# EAGLE design TBoard_2019 (EAGLE 9.1.0)
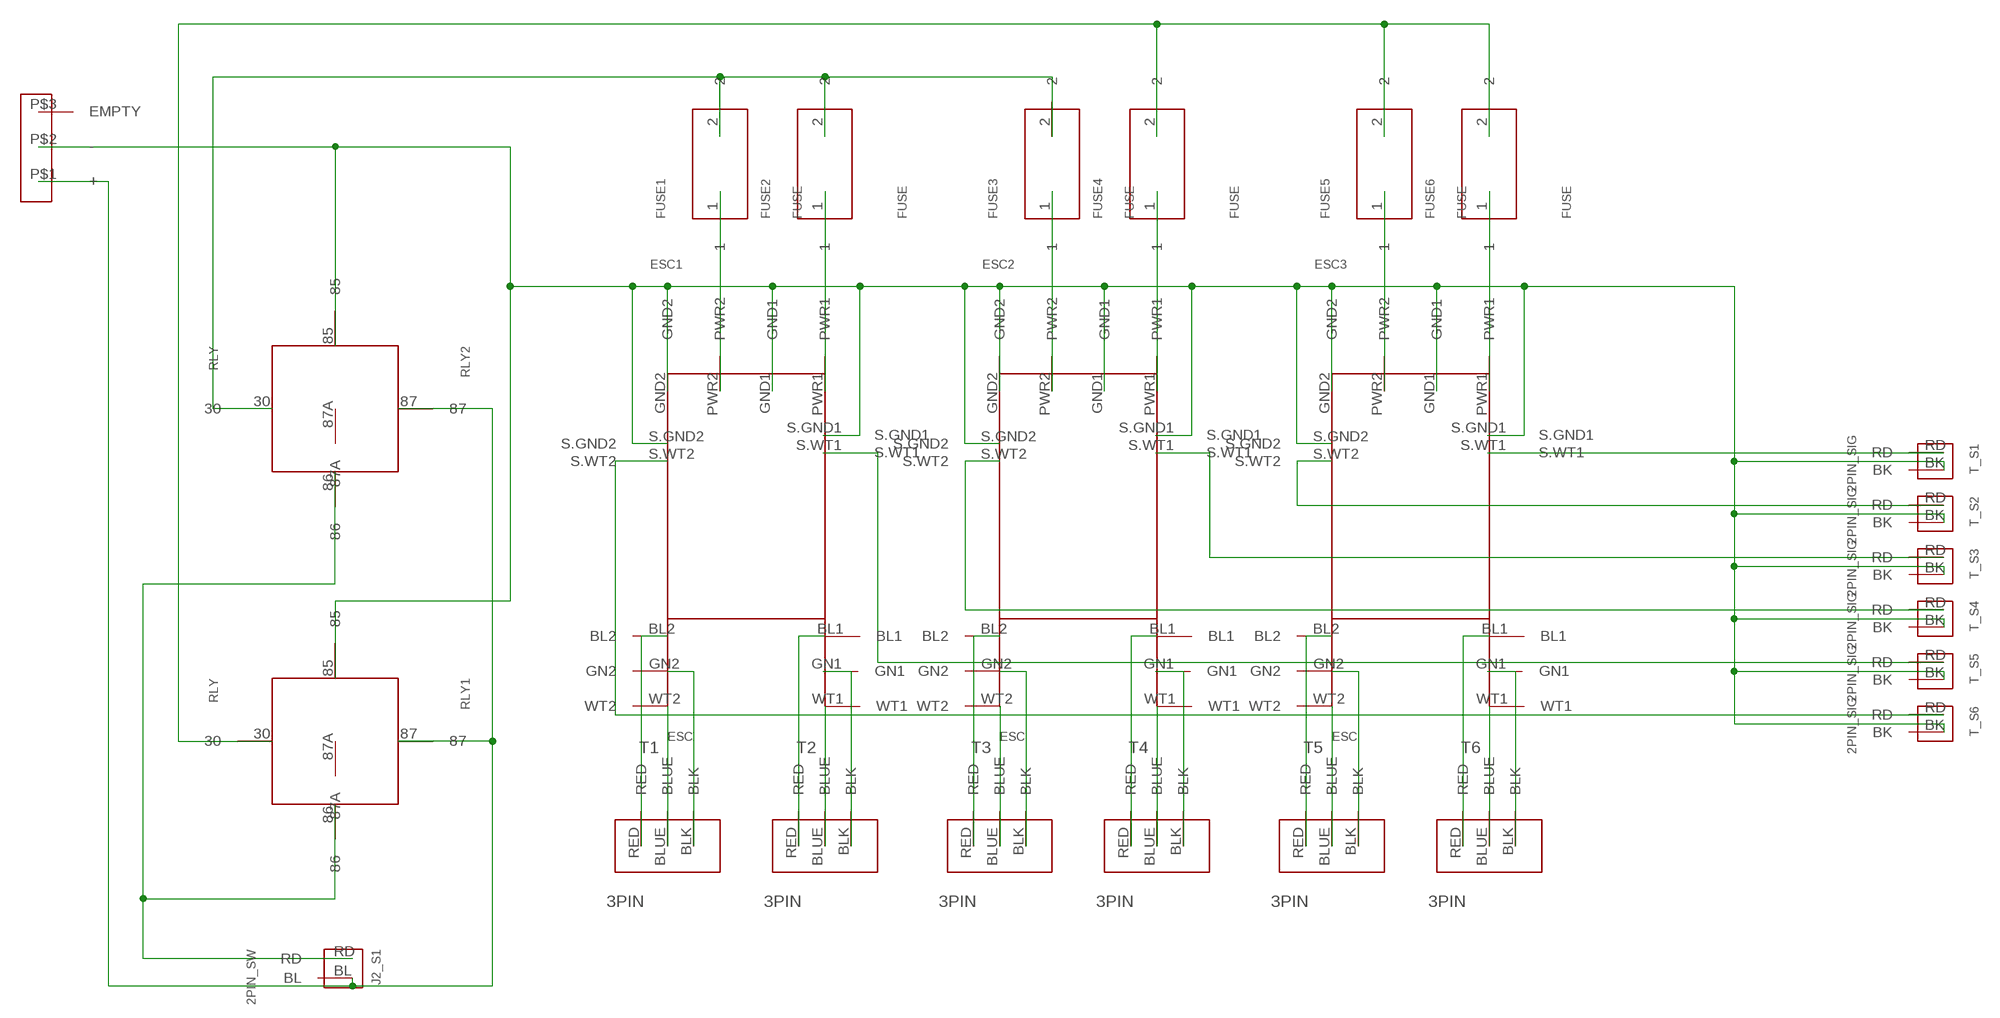
[diagram p0: schematic, sheet 1]

## Parts
ESC1  ESC  [ESC]
ESC2  ESC  [ESC]
ESC3  ESC  [ESC]
FUSE1  FUSE  [FUSE]
FUSE2  FUSE  [FUSE]
FUSE3  FUSE  [FUSE]
FUSE4  FUSE  [FUSE]
FUSE5  FUSE  [FUSE]
FUSE6  FUSE  [FUSE]
J2_S1  2PIN_SW  [2PIN_SW]
RLY1  RLY  [RLY]
RLY2  RLY  [RLY]
T1  3PIN  [3PIN]
T2  3PIN  [3PIN]
T3  3PIN  [3PIN]
T4  3PIN  [3PIN]
T5  3PIN  [3PIN]
T6  3PIN  [3PIN]
T_S1  2PIN_SIG  [2PIN_SIG]
T_S2  2PIN_SIG  [2PIN_SIG]
T_S3  2PIN_SIG  [2PIN_SIG]
T_S4  2PIN_SIG  [2PIN_SIG]
T_S5  2PIN_SIG  [2PIN_SIG]
T_S6  2PIN_SIG  [2PIN_SIG]
U$1  TERMINAL  [TERMINAL]

## Nets
N$1: ESC1.GND1 ESC1.GND2 ESC1.S.GND1 ESC1.S.GND2 ESC2.GND1 ESC2.GND2 ESC2.S.GND1 ESC2.S.GND2 ESC3.GND1 ESC3.GND2 ESC3.S.GND1 ESC3.S.GND2 RLY1.85 RLY2.85 T_S1.BK T_S2.BK T_S3.BK T_S4.BK T_S5.BK T_S6.BK U$1.P$2(-)
N$2: J2_S1.BL RLY1.87 RLY2.87 U$1.P$1(+)
N$3: J2_S1.RD RLY1.86 RLY2.86
N$4: ESC1.BL2 T1.RED
N$5: ESC1.GN2 T1.BLK
N$6: ESC1.WT2 T1.BLUE
N$7: ESC1.BL1 T2.RED
N$8: ESC1.GN1 T2.BLK
N$9: ESC1.WT1 T2.BLUE
N$10: ESC2.BL2 T3.RED
N$11: ESC2.GN2 T3.BLK
N$12: ESC2.WT2 T3.BLUE
N$13: ESC2.BL1 T4.RED
N$14: ESC2.GN1 T4.BLK
N$15: ESC2.WT1 T4.BLUE
N$16: ESC3.BL2 T5.RED
N$17: ESC3.GN2 T5.BLK
N$18: ESC3.WT2 T5.BLUE
N$19: ESC3.BL1 T6.RED
N$20: ESC3.GN1 T6.BLK
N$21: ESC3.WT1 T6.BLUE
N$22: FUSE4.2 FUSE5.2 FUSE6.2 RLY1.30
N$23: ESC1.PWR2 FUSE1.1
N$24: ESC1.PWR1 FUSE2.1
N$25: ESC2.PWR2 FUSE3.1
N$26: ESC2.PWR1 FUSE4.1
N$27: ESC3.PWR2 FUSE5.1
N$28: ESC3.PWR1 FUSE6.1
N$29: ESC3.S.WT1 T_S1.RD
N$30: ESC3.S.WT2 T_S2.RD
N$31: ESC2.S.WT1 T_S3.RD
N$32: ESC2.S.WT2 T_S4.RD
N$33: ESC1.S.WT1 T_S5.RD
N$34: ESC1.S.WT2 T_S6.RD
N$35: FUSE1.2 FUSE2.2 FUSE3.2 RLY2.30
Unconnected: RLY1.87A RLY2.87A U$1.P$3(EMPTY)

## Library data of the parts
ESC1-ESC3 = BLUE_ESC:ESC
FUSE1-FUSE6 = FUSE:FUSE
J2_S1 = 2PIN_BASE_SW:2PIN_SW
RLY1 RLY2 = 80A_RELAY:RLY
T1-T6 = 3PIN_BASE_CONNECTOR:3PIN
T_S1-T_S6 = 2PIN_BASE_SERVO:2PIN_SIG
U$1 = ThrusterBoardLibrary:TERMINAL

## Board
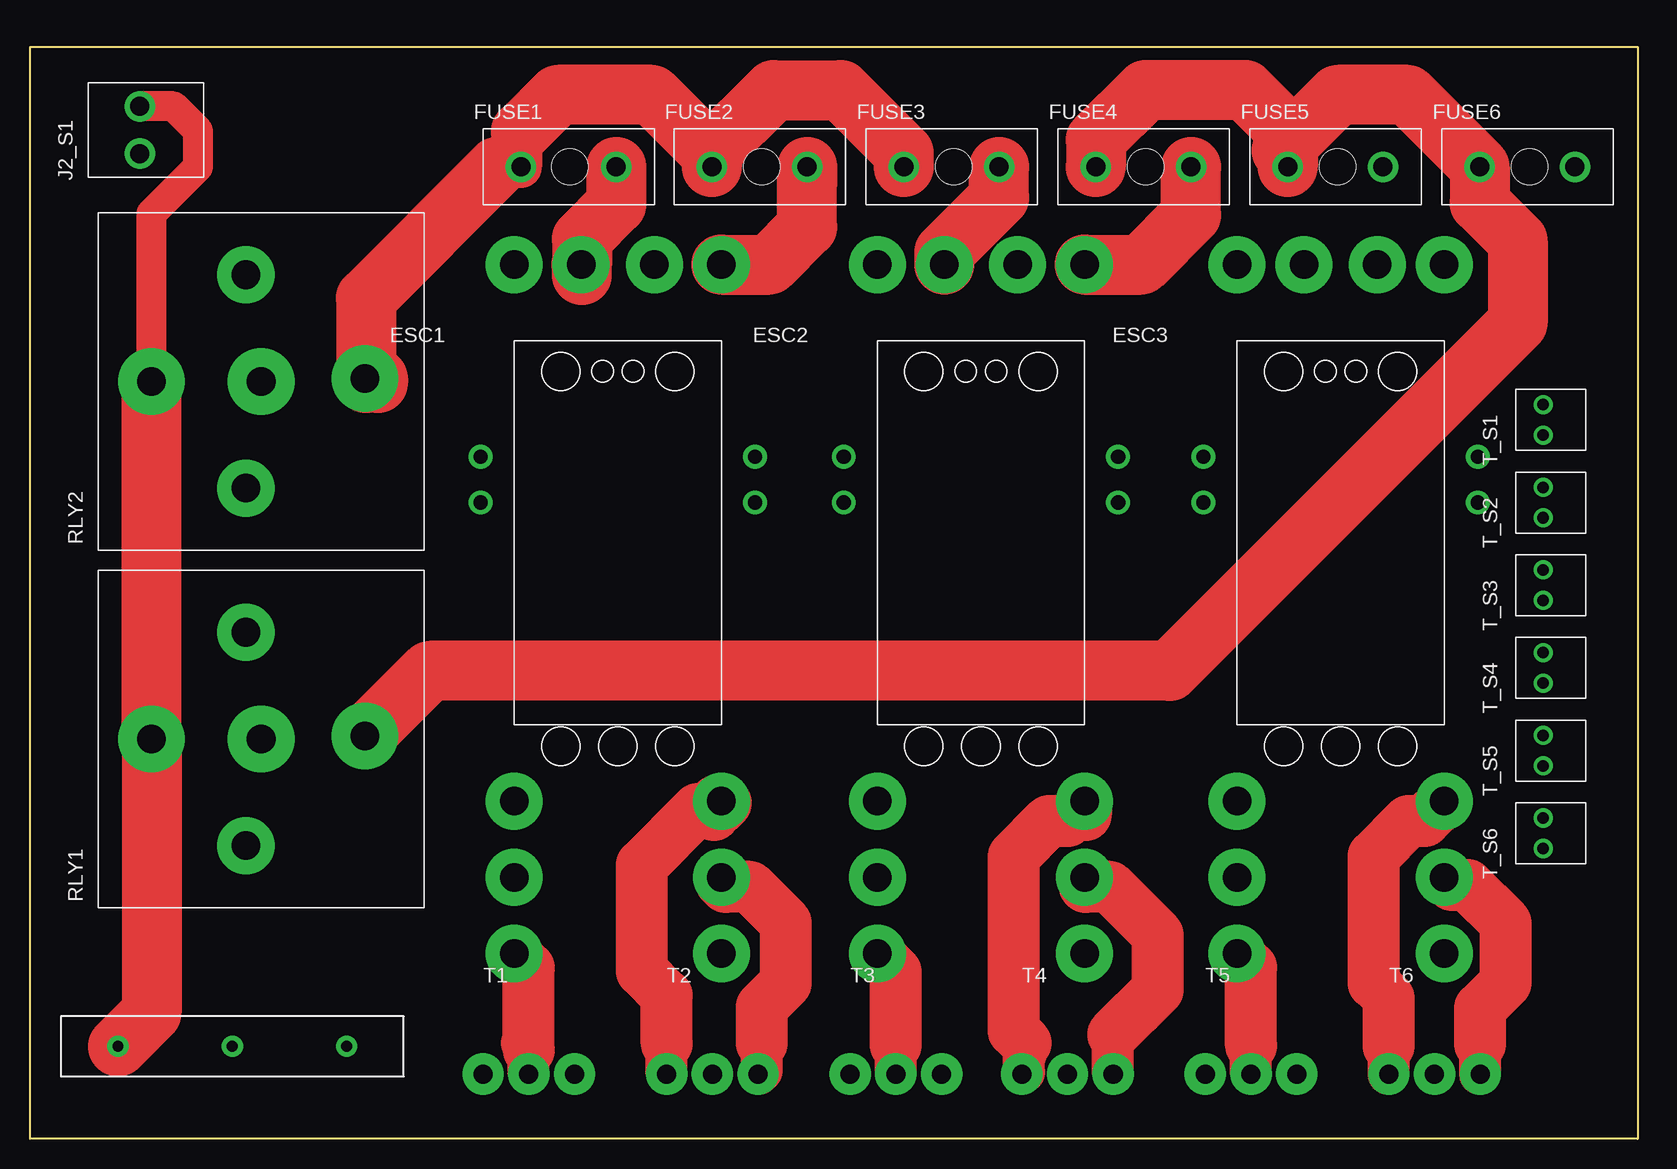
[diagram p1: board, top side]
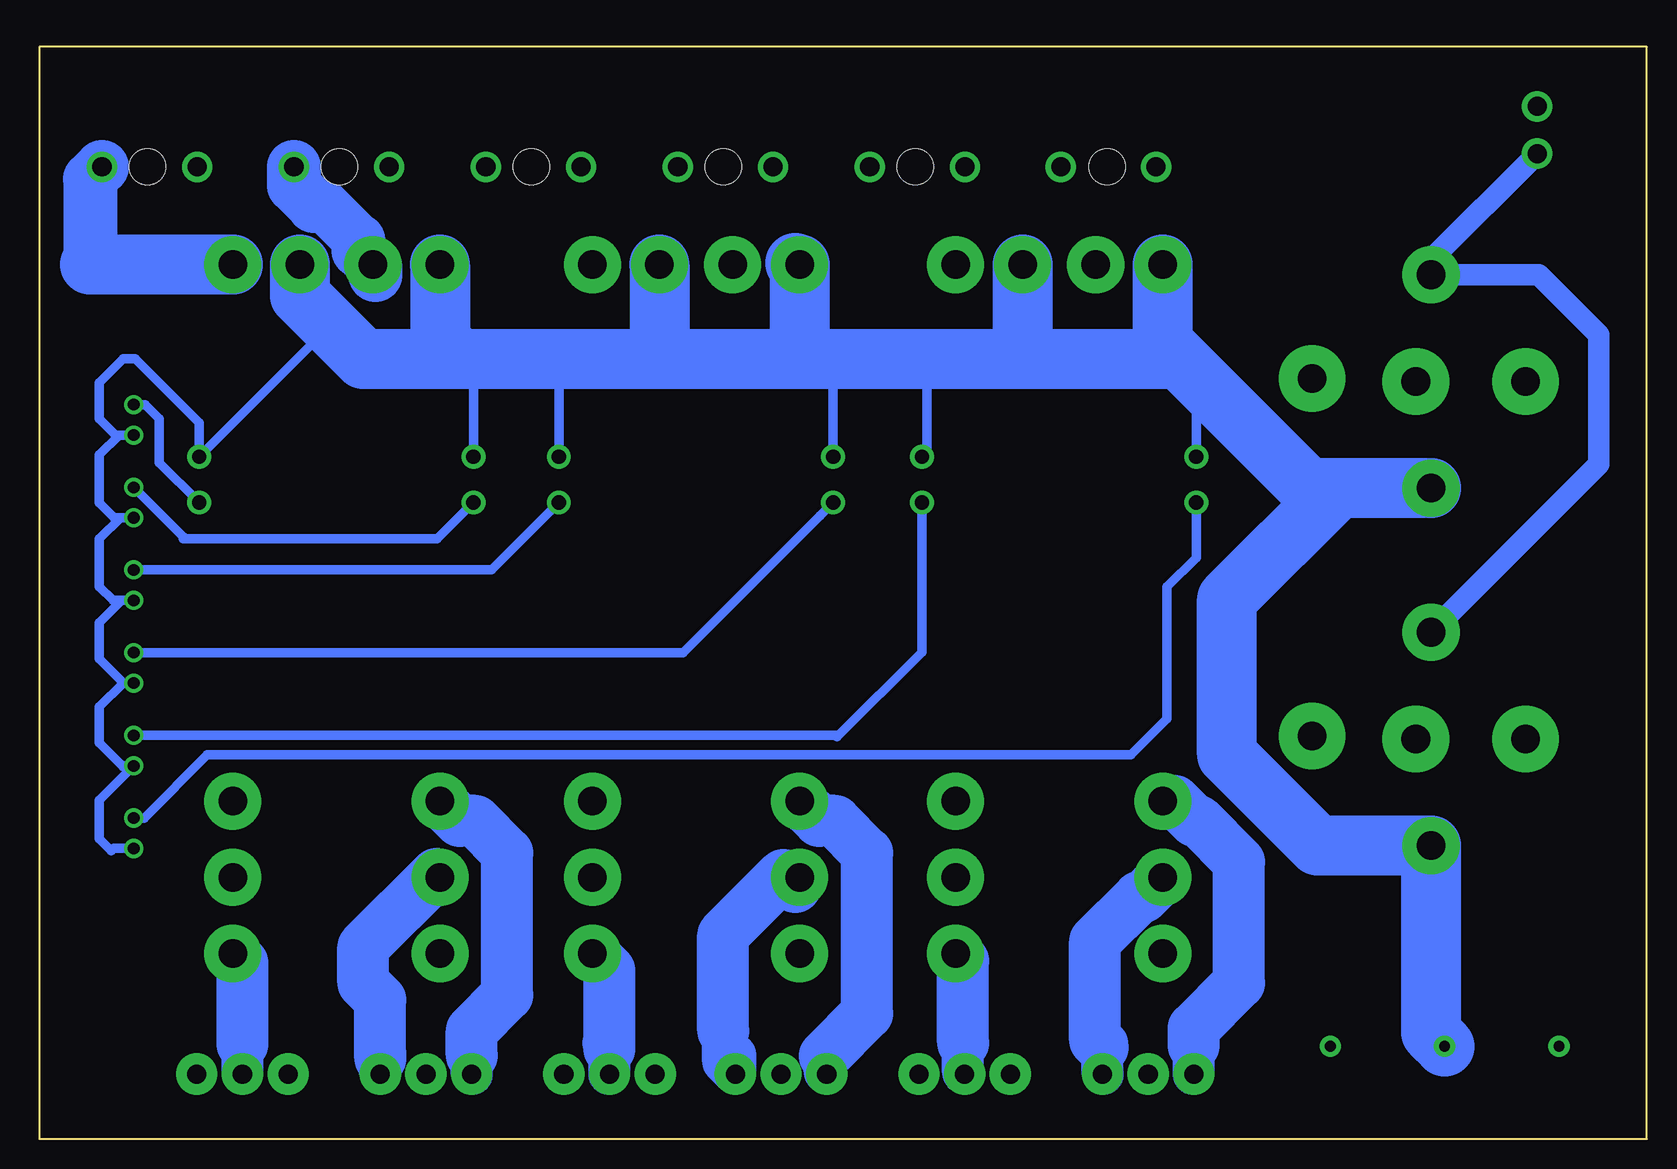
[diagram p2: board, bottom side, seen from below]

Size 134 x 91 mm. Coordinates in mm from the lower left corner, seen from the top.
Outline: 0,0 0,91 134,91 134,0 0,0
Copper layers (1*16): Top 0.035mm / dielectric 1.5mm / Bottom 0.035mm
Design rules "default": minimum track width 6mil, minimum drill 0.35mm, track to track 6mil, track to pad 6mil, pad to pad 6mil, via to via 6mil, smd to smd 6mil, copper to edge 40mil, drill to drill 6mil, minimum pad ring 10mil, minimum via ring 8mil, stop-mask expansion 4mil, vias tented up to drill 0mil, thermal gap 10mil
Holes 3 mm at 45,81 61,81 77,81 93,81 109,81 125,81

### Footprints (pad centres in the part's own frame; a part is rotated, then mirrored left to right if it is on the bottom)
ESC = drill 2.381 pad 4.763: BL1 8.636,-22.352; BL2 -8.636,-22.352; GN1 8.636,-28.702; GN2 -8.636,-28.702; GND1 3.048,22.352; GND2 -8.636,22.352; PWR1 8.636,22.352; PWR2 -3.048,22.352; WT1 8.636,-35.052; WT2 -8.636,-35.052 | drill 1.191 pad 1.984: S.GND1 11.43,6.35; S.GND2 -11.43,6.35; S.WT1 11.43,2.54; S.WT2 -11.43,2.54
FUSE = drill 1.587 pad 2.54: 1 3.969,0; 2 -3.969,0
2PIN_SW = drill 1.587 pad 2.54: BL 1.968,0; RD -1.968,0
RLY = drill 2.381 pad 5.556: 30 0.254,-8.636; 87 0,9.144; 87A 0,0 | drill 2.381 pad 4.763: 85 -8.89,1.27; 86 8.89,1.27
3PIN = drill 1.587 pad 3.445: BLK 3.81,0; BLUE 0,0; RED -3.81,0
2PIN_SIG = drill 0.965 pad 1.587: BK -1.27,0; RD 1.27,0
TERMINAL = drill 0.9 pad 1.778: P$1 4.765,2.5; P$2 14.295,2.5; P$3 23.825,2.5

### Placement (x,y rotation side)
ESC1  49,50.5 0 top
ESC2  79.27,50.5 0 top
ESC3  109.25,50.5 0 top
FUSE1  44.9,81 0 top
FUSE2  60.82,81 0 top
FUSE3  76.82,81 0 top
FUSE4  92.82,81 0 top
FUSE5  108.82,81 0 top
FUSE6  124.82,81 0 top
J2_S1  9.16,84.07 90 top
RLY1  19.27,33.33 90 top
RLY2  19.27,63.12 90 top
T1  41.58,5.4 0 top
T2  56.88,5.4 0 top
T3  72.18,5.4 0 top
T4  86.48,5.4 0 top
T5  101.78,5.4 0 top
T6  117.08,5.4 0 top
T_S1  126.14,59.92 90 top
T_S2  126.14,53.03 90 top
T_S3  126.14,46.14 90 top
T_S4  126.14,39.25 90 top
T_S5  126.14,32.36 90 top
T_S6  126.14,25.47 90 top
U$1  2.57,5.22 0 top

### Tracks (layer width: path | path; a pad name or v marks a point on that pad's centre or on a via)
N$1
  Bottom 0.8: ESC1.S.GND2 37.57,62.57 | 37.57,62.57 39,64 | 37.57,62.57 37,62 37,64 | 37,64 38,65 | 37,64 36,63 36,62 | ESC1.S.GND1 60,57.28 60,65 | ESC2.S.GND2 67.84,62.84 70,65 | ESC2.S.GND1 90.7,64.7 91,65 | ESC3.S.GND2 97.82,63.18 96,65 | 107,65 109,67 109,68 109.53,68 ESC3.S.GND1 120.68,59.68 126,65 127,65 129,63 129,60 127.65,58.65 T_S1.BK 127.35,58.65 129,57 129,53 127.76,51.76 T_S2.BK 127.24,51.76 129,50 129,46 127.87,44.87 T_S3.BK 127.13,44.87 129,43 129,40 126.98,37.98 T_S4.BK 127.02,37.98 129,36 129,33 127,31 126.91,31.09 T_S5.BK 129,28.23 129,25 128,24 127.8,24.2 T_S6.BK
  Bottom 5: RLY2.85 25.77,54.23 | 25.77,54.23 28.23,54.23 36,62 40.36,66.36 | 40.36,66.36 40.36,65 53,65 | 40.36,66.36 ESC1.GND2 | 71,73 70.85,72.85 ESC2.GND2 70.63,65.63 70,65 | ESC3.GND1 112.3,70.3 107,65 99,65 | 99,65 96,65 91,65 82,65 | 82,65 70,65 | 70,65 60,65 53,65 | ESC1.GND1 52.05,66.05 52,66 53,65 | ESC2.GND1 82.32,66.32 82,66 82,65 | ESC3.GND2 100.61,66.61 99,65 | 25.77,54.23 35,45 35,32 27.44,24.44 RLY1.85 18,8.86 U$1.P$2
N$2
  Top 2.5: RLY2.87 10.13,77.13 14,81 14,84 11.96,86.04 J2_S1.BL
  Top 5: RLY2.87 RLY1.87 10.13,10.51 U$1.P$1
N$3
  Bottom 1.8: J2_S1.RD 18,73.26 RLY2.86 9.01,72.01 4,67 4,56.22 RLY1.86
N$4
  Bottom 3.5: T1.RED 37.77,7.77 38,8
  Bottom 4.35: 37.77,7.77 37.77,9.23 34,13 34,23.09 37.41,26.51 37.72,26.51 39.36,28.15 ESC1.BL2
N$5
  Bottom 3.5: T1.BLK 45.39,7.61 45,8
  Bottom 4.35: 45.39,7.61 46,8.22 46,16.47 42.31,20.16 42.01,20.16 ESC1.GN2
N$6
  Top 3.5: T1.BLUE 41.58,7.42 41,8
  Top 4.35: 41.58,7.42 41.58,14.23 ESC1.WT2
N$7
  Top 3.5: T2.RED 53.07,7.93 53,8
  Top 4.35: 53.07,7.93 53.07,11.93 51,14 51,22.82 55.69,27.51 57.51,27.51 58,28 | 57,27 57,28 57.15,28.15 ESC1.BL1
N$8
  Top 3.5: T2.BLK 61,5.71 61,8
  Top 4.35: 61,8 61,11 63,13 63,18 60,21 58,21 57.64,21.36 ESC1.GN1
N$9
  Bottom 3.5: T2.BLUE 57,5.52 57,8
  Bottom 4.35: 57,8 57,14.81 ESC1.WT1
N$10
  Bottom 3.5: T3.RED 68.56,5.58 68.56,6.9 68.83,7.17
  Bottom 4.35: 68.56,6.9 65,10.46 65,23.82 67.68,26.51 68.99,26.51 ESC2.BL2
N$11
  Bottom 3.5: 76,7 75.99,6.99 T3.BLK 77,6.41 77,9
  Bottom 4.35: 77,9 77,17 72,22 71,21 71,21.43 ESC2.GN2
N$12
  Top 3.5: T3.BLUE 72.18,7.82 72,8
  Top 4.35: 72.18,7.82 72.18,13.9 ESC2.WT2
N$13
  Top 3.5: T4.RED 82.86,5.58 82.86,6.9 83,7.05 83,8
  Top 4.35: 83,8 82,9 82,23.55 84.96,26.51 86.51,26.51 88,28 | 88,28 88,27 | 88,28 88,28.05 ESC2.BL1
N$14
  Top 3.5: T4.BLK 90.29,8.71 90,9
  Top 4.35: 90.29,8.71 94,12.42 94,17 90,21 88,21 87.91,21.09 ESC2.GN1
N$15
  Bottom 3.5: T4.BLUE 86.48,7.48 87,8
  Bottom 4.35: 86.48,7.48 86.48,14.02 ESC2.WT1
N$16
  Bottom 3.5: T5.RED 97.97,6.97 98,7
  Bottom 4.35: 97.97,6.97 97.97,9.03 95,12 95,23.84 97.66,26.51 98.97,26.51 ESC3.BL2
N$17
  Bottom 3.5: T5.BLK 105.59,6.72 105.15,7.15
  Bottom 4.35: 105.59,6.72 105.59,11.59 107,13 107,16 100.91,22.09 ESC3.GN2
N$18
  Top 3.5: T5.BLUE 101.78,7.78 102,8
  Top 4.35: 101.78,7.78 101.78,14.28 ESC3.WT2
N$19
  Top 3.5: T6.RED 113.27,7.73 113,8
  Top 4.35: 113.27,7.73 113.27,11.73 112,13 112,23.57 114.94,26.51 116.25,26.51 ESC3.BL1
N$20
  Top 3.5: T6.BLK 120.89,7.89 121,8
  Top 4.35: 120.89,7.89 120.89,10.89 123,13 123,17.99 119.84,21.16 118.53,21.16 ESC3.GN1
N$21
  Bottom 3.5: T6.BLUE 117.08,7.92 117,8
  Bottom 4.35: 117.08,7.92 117.08,14.64 ESC3.WT1
N$22
  Top 5: 105.35,83.35 109,87 114.85,87 FUSE6.2 120.85,78 124,74.85 124,68 95,39 33.32,39 RLY1.30 | 105.35,83.35 104.35,82.35 104.85,81.85 FUSE5.2 | 105.35,83.35 101.3,87.41 93,87.41 88.85,83.26 FUSE4.2
N$23
  Top 5: FUSE1.1 48.87,77.87 46,75 46,72.8 | 46,72 46,72.8 | 46,72.8 ESC1.PWR2
N$24
  Top 5: 64.79,79.71 FUSE2.1 64.79,76 61.64,72.85 ESC1.PWR1
N$25
  Top 5: FUSE3.1 80.79,78.44 76.22,73.88 ESC2.PWR2
N$26
  Top 5: ESC2.PWR1 92.64,72.85 96.79,77 FUSE4.1
N$27
  Bottom 4.3: 107.4,74.88 110.27,77.75 111.1,77.75
  Bottom 4.5: 106,72 106,72.65 ESC3.PWR2 107.4,74.05 107.4,74.88 | FUSE5.1 112.79,79.44 111.1,77.75
N$28
  Bottom 4.5: FUSE6.1 129.79,80 129.79,72.85
  Bottom 5: ESC3.PWR1 129.79,72.85
N$29
  Bottom 0.8: ESC3.S.WT1 124,56.36 124,60 125.19,61.19 T_S1.RD
N$30
  Bottom 0.8: ESC3.S.WT2 100.86,50 122,50 122,50.16 T_S2.RD
N$31
  Bottom 0.8: ESC2.S.WT1 96.33,47.41 T_S3.RD
N$32
  Bottom 0.8: ESC2.S.WT2 68.94,51.94 80.36,40.52 T_S4.RD
N$33
  Bottom 0.8: ESC1.S.WT1 60.43,40.57 67.5,33.5 67.63,33.63 T_S5.RD
N$34
  Bottom 0.8: ESC1.S.WT2 37.57,48.43 40,46 40,35 43,32 120,32 125.26,26.74 T_S6.RD
N$35
  Top 3.5: 40.93,83.93 FUSE1.2 38.93,81
  Top 5: FUSE3.2 72.85,82.15 67.59,87.41 62,87.41 56.72,82.13 | FUSE2.2 56.85,82 56.72,82.13 | 56.72,82.13 51.85,87 44,87 40.93,83.93 | 38.93,81 28,70.07 28,64 | 28,63 28,64 | 28,64 29,63 29,63.37 RLY2.30